# Altium schematic sheet DSP connections.SchDoc
size A; SheetNumber: 2; SheetTotal: 6
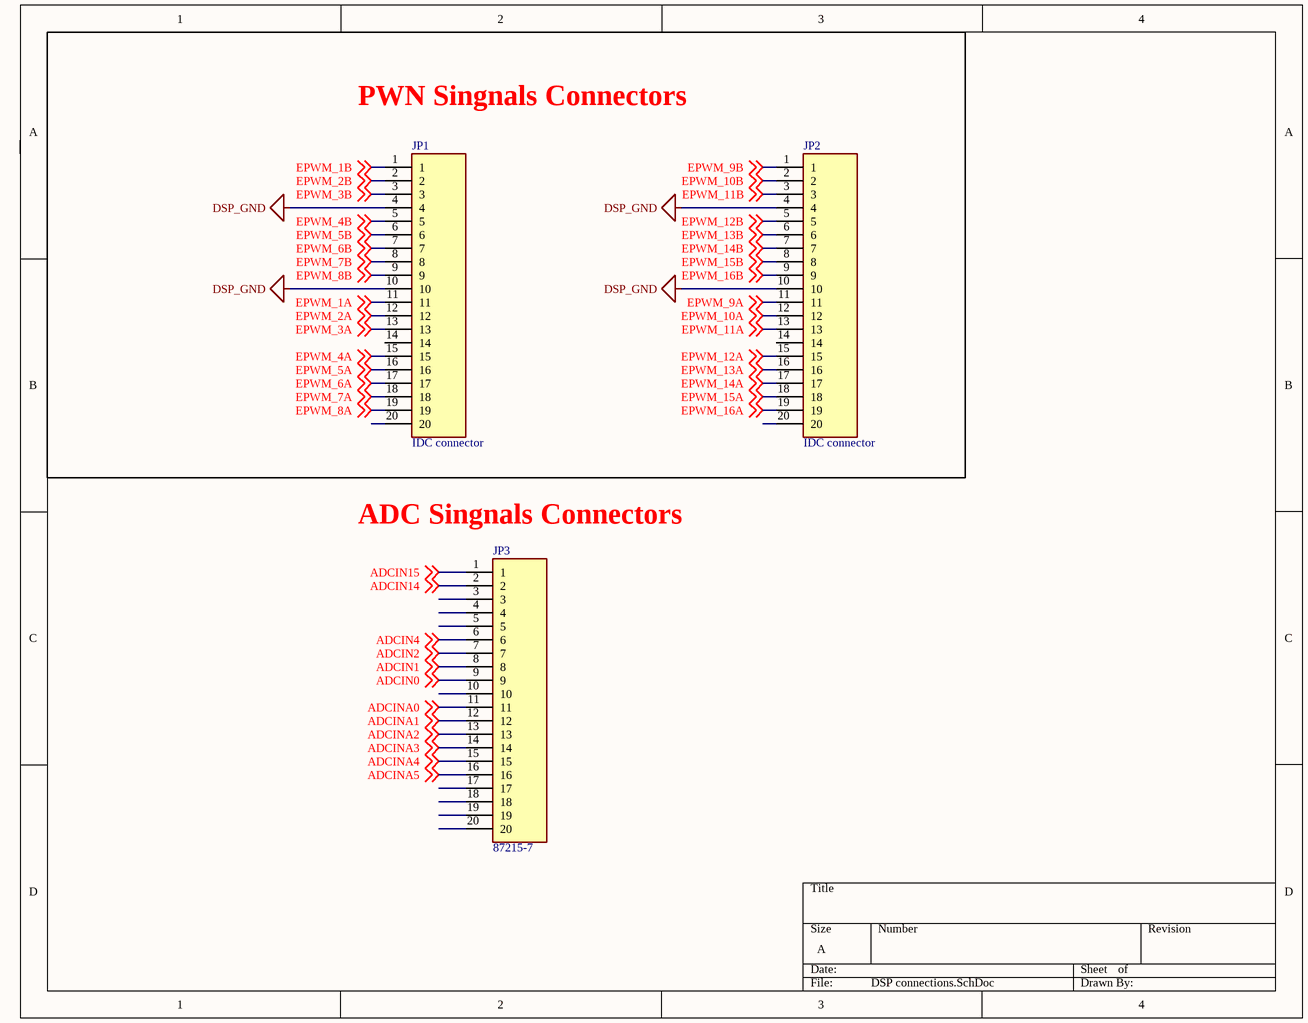
[diagram p0: DSP connections.SchDoc]

## Parts
JP1  IDC connector  [TE_87215-7]
JP2  IDC connector  [TE_87215-7]
JP3  87215-7  [TE_87215-7]

## Blocks framed on the sheet
PWN Singnals Connectors: JP1 JP2

## Nets
DSP_GND: JP1.4 JP1.10 JP2.4 JP2.10
ADCIN0: JP3.9 ; off-sheet ADCIN0
ADCIN1: JP3.8 ; off-sheet ADCIN1
ADCIN2: JP3.7 ; off-sheet ADCIN2
ADCIN4: JP3.6 ; off-sheet ADCIN4
ADCIN14: JP3.2 ; off-sheet ADCIN14
ADCIN15: JP3.1 ; off-sheet ADCIN15
ADCINA0: JP3.11 ; off-sheet ADCINA0
ADCINA1: JP3.12 ; off-sheet ADCINA1
ADCINA2: JP3.13 ; off-sheet ADCINA2
ADCINA3: JP3.14 ; off-sheet ADCINA3
ADCINA4: JP3.15 ; off-sheet ADCINA4
ADCINA5: JP3.16 ; off-sheet ADCINA5
EPWM_1A: JP1.11 ; off-sheet EPWM_1A
EPWM_1B: JP1.1 ; off-sheet EPWM_1B
EPWM_2A: JP1.12 ; off-sheet EPWM_2A
EPWM_2B: JP1.2 ; off-sheet EPWM_2B
EPWM_3A: JP1.13 ; off-sheet EPWM_3A
EPWM_3B: JP1.3 ; off-sheet EPWM_3B
EPWM_4A: JP1.15 ; off-sheet EPWM_4A
EPWM_4B: JP1.5 ; off-sheet EPWM_4B
EPWM_5A: JP1.16 ; off-sheet EPWM_5A
EPWM_5B: JP1.6 ; off-sheet EPWM_5B
EPWM_6A: JP1.17 ; off-sheet EPWM_6A
EPWM_6B: JP1.7 ; off-sheet EPWM_6B
EPWM_7A: JP1.18 ; off-sheet EPWM_7A
EPWM_7B: JP1.8 ; off-sheet EPWM_7B
EPWM_8A: JP1.19 ; off-sheet EPWM_8A
EPWM_8B: JP1.9 ; off-sheet EPWM_8B
EPWM_9A: JP2.11 ; off-sheet EPWM_9A
EPWM_9B: JP2.1 ; off-sheet EPWM_9B
EPWM_10A: JP2.12 ; off-sheet EPWM_10A
EPWM_10B: JP2.2 ; off-sheet EPWM_10B
EPWM_11A: JP2.13 ; off-sheet EPWM_11A
EPWM_11B: JP2.3 ; off-sheet EPWM_11B
EPWM_12A: JP2.15 ; off-sheet EPWM_12A
EPWM_12B: JP2.5 ; off-sheet EPWM_12B
EPWM_13A: JP2.16 ; off-sheet EPWM_13A
EPWM_13B: JP2.6 ; off-sheet EPWM_13B
EPWM_14A: JP2.17 ; off-sheet EPWM_14A
EPWM_14B: JP2.7 ; off-sheet EPWM_14B
EPWM_15A: JP2.18 ; off-sheet EPWM_15A
EPWM_15B: JP2.8 ; off-sheet EPWM_15B
EPWM_16A: JP2.19 ; off-sheet EPWM_16A
EPWM_16B: JP2.9 ; off-sheet EPWM_16B

Not connected (* = marked no-connect by the designer): JP1 14 20; JP2 14 20; JP3 3 4 5 10 17 18 19 20

## Notes on the sheet
- (near JP3) ADC Singnals Connectors

## Library data of the parts
JP1-JP3 = 87215-7: 20 MODII HDR DRST UNSHRD .100; MF: TE Connectivity; Value: *; Price: None; Availability: Unavailable; SnapEDA_Link: https://www.snapeda.com/parts/87215-7/TE%20Connectivity/view-part/283412/?ref=snap; Package: None; MP: 87215-7